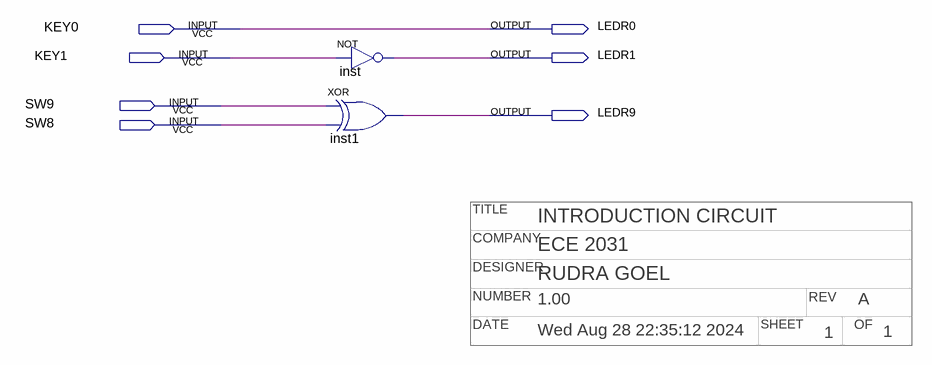
[diagram p0: schematic sheet]
// Quartus schematic IntroCircuit.bdf as structural Verilog: 2 symbols, 7 pins
// Title block: COMPANY: ECE 2031; DATE: Wed Aug 28 22:35:12 2024; DESIGNER: RUDRA GOEL; NUMBER: 1.00; OF: 1; REV: A; SHEET: 1; TITLE: INTRODUCTION CIRCUIT
module IntroCircuit (
  input  KEY0,
  input  KEY1,
  input  SW9,
  input  SW8,
  output LEDR0,
  output LEDR1,
  output LEDR9
);

  not inst (LEDR1, KEY1);
  xor inst1 (LEDR9, SW9, SW8);

  assign LEDR0 = KEY0;
endmodule
